# Altium schematic sheet LowSideVoltageMonitor (3).SchDoc
size A4; SheetNumber: 5; SheetTotal: 5
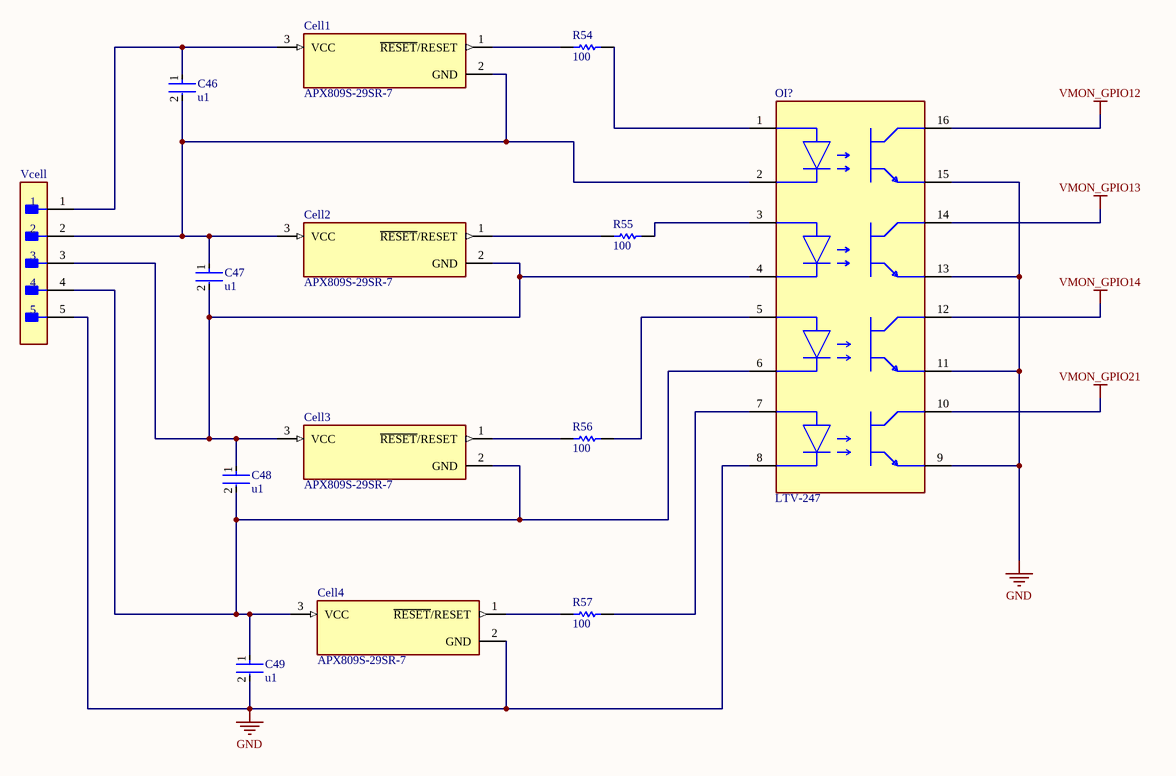
[diagram p0: LowSideVoltageMonitor (3).SchDoc]

## Parts
C46  u1  [FP-CC0805-0_85-MFG]
C47  u1  [FP-CC0805-0_85-MFG]
C48  u1  [FP-CC0805-0_85-MFG]
C49  u1  [FP-CC0805-0_85-MFG]
Cell1  APX809S-29SR-7  [SOT91P240X110-3N]
Cell2  APX809S-29SR-7  [SOT91P240X110-3N]
Cell3  APX809S-29SR-7  [SOT91P240X110-3N]
Cell4  APX809S-29SR-7  [SOT91P240X110-3N]
OI?  LTV-247  [FP-LTV-247-MFG]
R54  100  [RESC2013X60X35ML10T20]
R55  100  [RESC2013X60X35ML10T20]
R56  100  [RESC2013X60X35ML10T20]
R57  100  [RESC2013X60X35ML10T20]
Vcell  S5B-XH-A(LF)(SN)  [FP-S5B-XH-A_LF_SN-MFG]  (value not drawn)

## Nets
GND: C49.2 Cell4.2(GND) OI?.8(4_CATHODE) OI?.9(E) OI?.11(E) OI?.13(E) OI?.15(E) Vcell.5
VMON_GPIO12: OI?.16(C)
VMON_GPIO13: OI?.14(C)
VMON_GPIO14: OI?.12(C)
VMON_GPIO21: OI?.10(C)
NetC46_1: C46.1 Cell1.3(VCC) Vcell.1
NetC46_2: C46.2 C47.1 Cell1.2(GND) Cell2.3(VCC) OI?.2(1_CATHODE) Vcell.2
NetC47_2: C47.2 C48.1 Cell2.2(GND) Cell3.3(VCC) OI?.4(2_CATHODE) Vcell.3
NetC48_2: C48.2 C49.1 Cell3.2(GND) Cell4.3(VCC) OI?.6(3_CATHODE) Vcell.4
NetCell1_1: Cell1.1(~{RESET}/RESET) R54.1
NetCell2_1: Cell2.1(~{RESET}/RESET) R55.1
NetCell3_1: Cell3.1(~{RESET}/RESET) R56.1
NetCell4_1: Cell4.1(~{RESET}/RESET) R57.1
NetOI?_1: OI?.1(1_ANODE) R54.2
NetOI?_3: OI?.3(2_ANODE) R55.2
NetOI?_5: OI?.5(3_ANODE) R56.2
NetOI?_7: OI?.7(4_ANODE) R57.2

## Library data of the parts
C46-C49 = CMP-2100-03606-3: CC0805KRX7R9BB104 CAP CER 0.1UF 50V X7R 0805; Manufacturer: Yageo; Tolerance: 0.1; Capacitance: 100 nF; Value: 100 nF; Material: Ceramic; Device Class L1: Passive Components; ComponentLink2Description: Datasheet; Package: CC0805-0.85; Manufacturer Part Number: CC0805KRX7R9BB104; Digikey Description: CAP CER 0.1UF 50V X7R 0805; Device Class L3: Ceramic Capacitors; Temperature: -30°C to +85°C; Temperature Characteristic: X7R; Voltage Rating: 50 V; Height: 0.95mm; RoHS: TRUE; Ipc Land Pattern Name: CAPC200125X85; Device Class L2: Capacitors; Category: Cap; Temperature Range Low: -30°C; Temperature Range High: +85°C; Mouser Description: Multilayer Ceramic Capacitors MLCC - SMD/SMT 100nF 50V X7R 10%; Footprint Url: http://www.yageo.com/exep/pages/download/literatures/UPY-C_GEN_24.pdf; Automotive: No; Octopart: https://octopart.com/cc0805krx7r9bb104-yageo-192993; Lead Free: Yes; ComponentLink2URL: http://www.yageo.com/documents/recent/UPY-GPHC_Y5V_6.3V-to-50V_8.pdf
Cell1-Cell4 = APX809S-29SR-7: Supervisor Push-Pull, Totem Pole 1 Channel SOT-23-3; MF: Diodes Inc.; SnapEDA_Link: https://www.snapeda.com/parts/APX809S-29SR-7/Diodes+Inc./view-part/?ref=snap; Package: SOT-23-3 Diodes Inc.; Value: *; MP: APX809S-29SR-7; Check_prices: https://www.snapeda.com/parts/APX809S-29SR-7/Diodes+Inc./view-part/?ref=eda
OI? = CMP-22018-000010-1: OPTOISO 3.75KV 4CH TRANS 16SO; Forward Voltage: 1.2V; Collector Emitter Voltage (VCEO): 80V; Forward Current: 20mA; Output Current per Channel: 50mA; Power Dissipation: 170mW; Reverse Breakdown Voltage: 6V; Max Power Dissipation: 200mW; Current Transfer Ratio: 600%; Number of Elements: 4; Collector Emitter Saturation Voltage: 400mV; Package Quantity: 2000; Mount: Surface Mount; Max Operating Temperature: 110°C; Packaging: Tape and Reel; RoHS Compliant: Yes; Case/Package: SMD/SMT; Number of Pins: 16; Min Operating Temperature: -55°C; Max Output Voltage: 80V; Number of Channels: 4; Radiation Hardening: No; Max Input Current: 50mA; Max Collector Current: 50mA
R54-R57 = CMP-2100-03669-1: RC0805FR-07100RL Chip Resistor, 100 Ohm, +/-1%, 0.125 W, -55 to 155 degC, 0805 (2012 Metric), RoHS, Tape and Reel; Manufacturer: Yageo; Power Rating: 125mW; Resistance: 100Ohm; Voltage Rating: 150V; Tolerance: 1%; Temperature Coefficient: 100ppm/degreesC; Length: 2mm; Package Description: 2-Pin Surface Mounted Device, Body 2 x 1.25 mm; Case Code (Imperial): 0805; Number of Pins: 2; Termination: SMD/SMT; Lead Pitch: 0.4mm; Package Quantity: 1; Height: 0.024inch; Case Code (Metric): 2012; Number of Terminations: 2; Datasheet Version: Rev. 5, 10/2016; Lead Free: LeadFree; Package Reference: 0805; Composition: ThickFilm; REACH SVHC: Unknown; Voltage Rating (DC): 150V; Min Operating Temperature: -55degC; Packaging: TapeandReel; Military Standard: Not; Case/Package: 0805; Datasheet URL: http://www.yageo.com/NewPortal/yageodocoutput?fileName=/pdf/R-Chip/PYu-RC_Group_51_RoHS_L_5.pdf; Max Operating Temperature: 155degC; Manufacturer URL: http://www.yageo.com/; Max Power Dissipation: 125mW; Width: 0.049inch; Depth: 1.25mm; RoHSCompliant: true
Vcell = CMP-17439-000302-1: CONN HEADER R/A 5POS 2.5MM; Contact Resistance: 10mR; Voltage Rating: 250V; Number of Contacts: 5; Current Rating: 3A; Insulation Resistance: 1GR; Wire/Cable Gauge: 22AWG; Number of Rows: 1; Contact Plating: Tin; Fastening Type: Detent; Contact Finish - Mating: TIN; Contact Material: Brass; Lead Free: Lead Free; Connector Type: Header; REACH SVHC: No SVHC; Insulation Color: Natural; Orientation: Right Angle; Contact Type: Male Pin; Pitch: 2.5mm; Contact Shape: Square; Series: XH; Color: Natural; Lead Pitch: 2.5mm; Mount: Through Hole; Termination: Solder; Max Operating Temperature: 85°C; Number of Positions: 5; Flammability Rating: UL94 V-0; Min Operating Temperature: -25°C; Packaging: Bulk; Voltage Rating (AC): 250V; Insulation Material: Nylon